# EAGLE design xmas_tree_pcb_A (EAGLE 6.2)
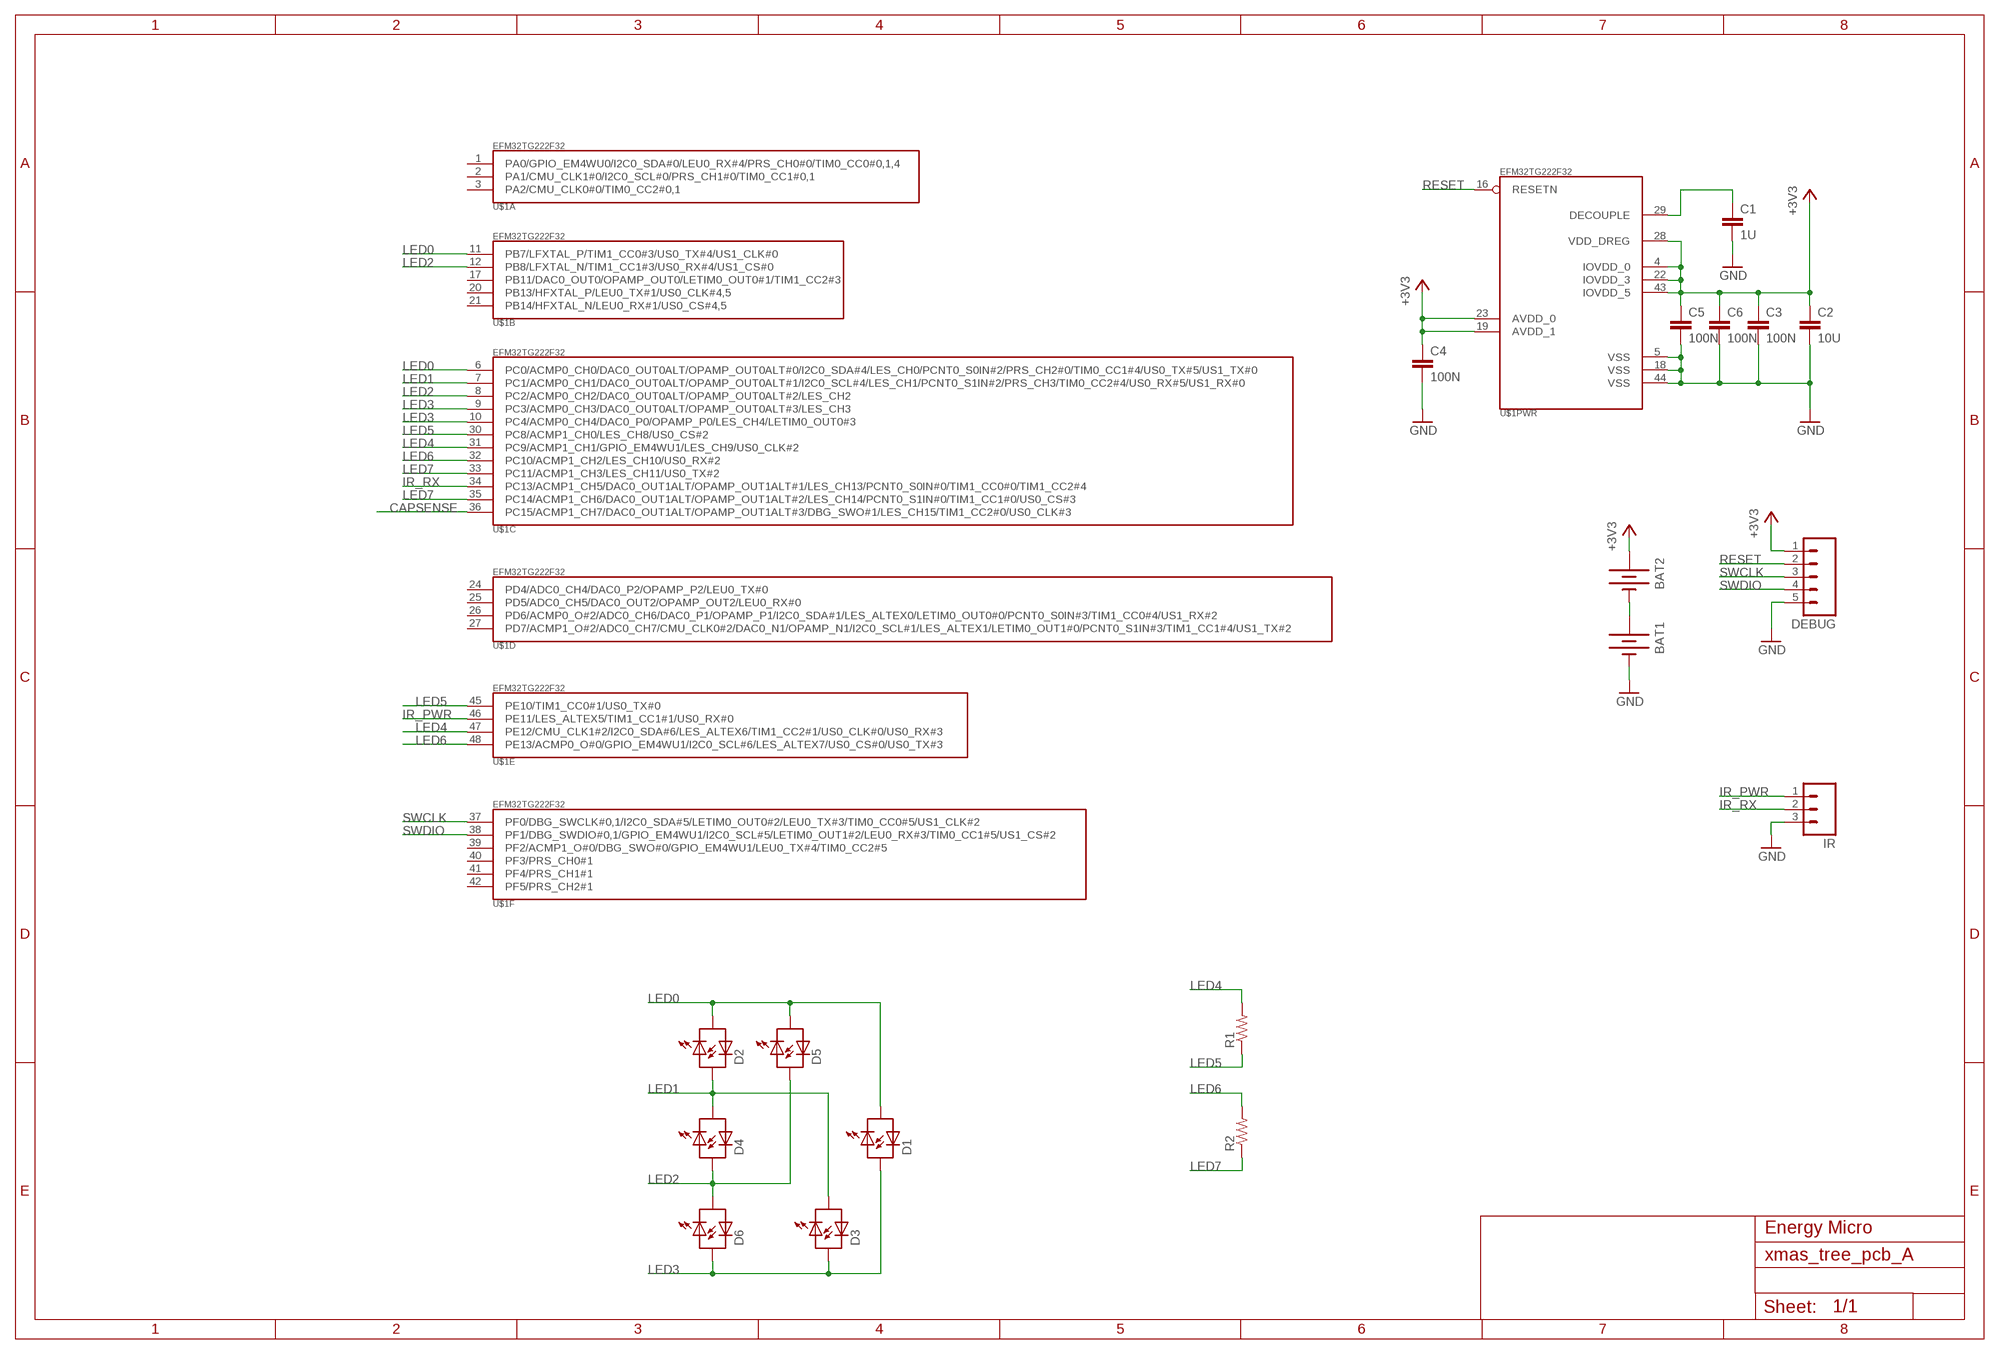
[diagram p0: schematic, sheet 1]

## Parts
BAT1  BATTERYAAA  [BATTERY-AAA]
BAT2  BATTERYAAA  [BATTERY-AAA]
C1  1U  C-EUC0603  [C0603]
C2  10U  C-EUC0603  [C0603]
C3  100N  C-EUC0603  [C0603]
C4  100N  C-EUC0603  [C0603]
C5  100N  C-EUC0603  [C0603]
C6  100N  C-EUC0603  [C0603]
D1  LED_BI_COLOR  [LED3MM]
D2  LED_BI_COLOR  [LED3MM]
D3  LED_BI_COLOR  [LED3MM]
D4  LED_BI_COLOR  [LED3MM]
D5  LED_BI_COLOR  [LED3MM]
D6  LED_BI_COLOR  [LED3MM]
DEBUG  M05LOCK  [1X05_LOCK]
IR  M03LOCK  [1X03_LOCK]
R1  RESISTOR1206  [1206]
R2  RESISTOR1206  [1206]
U$1  EFM32TG222F32  [QFP48]

## Nets
+3V3: BAT2.PWR@1(+) C2.1 C3.1 C4.1 C5.1 C6.1 DEBUG.1 U$1.4(PWR:IOVDD_0) U$1.19(PWR:AVDD_1) U$1.22(PWR:IOVDD_3) U$1.23(PWR:AVDD_0) U$1.28(PWR:VDD_DREG) U$1.43(PWR:IOVDD_5)
CAPSENSE: U$1.36(C:PC15/ACMP1_CH7/DAC0_OUT1ALT/OPAMP_OUT1ALT#3/DBG_SWO#1/LES_CH15/TIM1_CC2#0/US0_CLK#3)
GND: BAT1.GND@1(-) C1.2 C2.2 C3.2 C4.2 C5.2 C6.2 DEBUG.5 IR.3 U$1.5(PWR:VSS) U$1.18(PWR:VSS) U$1.44(PWR:VSS)
IR_PWR: IR.1 U$1.46(E:PE11/LES_ALTEX5/TIM1_CC1#1/US0_RX#0)
IR_RX: IR.2 U$1.34(C:PC13/ACMP1_CH5/DAC0_OUT1ALT/OPAMP_OUT1ALT#1/LES_CH13/PCNT0_S0IN#0/TIM1_CC0#0/TIM1_CC2#4)
LED0: D1.K(C1) D2.K(C1) D5.K(C1) U$1.6(C:PC0/ACMP0_CH0/DAC0_OUT0ALT/OPAMP_OUT0ALT#0/I2C0_SDA#4/LES_CH0/PCNT0_S0IN#2/PRS_CH2#0/TIM0_CC1#4/US0_TX#5/US1_TX#0) U$1.11(B:PB7/LFXTAL_P/TIM1_CC0#3/US0_TX#4/US1_CLK#0)
LED1: D2.A(A1) D3.K(C1) D4.K(C1) U$1.7(C:PC1/ACMP0_CH1/DAC0_OUT0ALT/OPAMP_OUT0ALT#1/I2C0_SCL#4/LES_CH1/PCNT0_S1IN#2/PRS_CH3/TIM0_CC2#4/US0_RX#5/US1_RX#0)
LED2: D4.A(A1) D5.A(A1) D6.K(C1) U$1.8(C:PC2/ACMP0_CH2/DAC0_OUT0ALT/OPAMP_OUT0ALT#2/LES_CH2) U$1.12(B:PB8/LFXTAL_N/TIM1_CC1#3/US0_RX#4/US1_CS#0)
LED3: D1.A(A1) D3.A(A1) D6.A(A1) U$1.9(C:PC3/ACMP0_CH3/DAC0_OUT0ALT/OPAMP_OUT0ALT#3/LES_CH3) U$1.10(C:PC4/ACMP0_CH4/DAC0_P0/OPAMP_P0/LES_CH4/LETIM0_OUT0#3)
LED4: R1.2 U$1.31(C:PC9/ACMP1_CH1/GPIO_EM4WU1/LES_CH9/US0_CLK#2) U$1.47(E:PE12/CMU_CLK1#2/I2C0_SDA#6/LES_ALTEX6/TIM1_CC2#1/US0_CLK#0/US0_RX#3)
LED5: R1.1 U$1.30(C:PC8/ACMP1_CH0/LES_CH8/US0_CS#2) U$1.45(E:PE10/TIM1_CC0#1/US0_TX#0)
LED6: R2.2 U$1.32(C:PC10/ACMP1_CH2/LES_CH10/US0_RX#2) U$1.48(E:PE13/ACMP0_O#0/GPIO_EM4WU1/I2C0_SCL#6/LES_ALTEX7/US0_CS#0/US0_TX#3)
LED7: R2.1 U$1.33(C:PC11/ACMP1_CH3/LES_CH11/US0_TX#2) U$1.35(C:PC14/ACMP1_CH6/DAC0_OUT1ALT/OPAMP_OUT1ALT#2/LES_CH14/PCNT0_S1IN#0/TIM1_CC1#0/US0_CS#3)
N$4: C1.1 U$1.29(PWR:DECOUPLE)
N$11: BAT1.PWR@1(+) BAT2.GND@1(-)
RESET: DEBUG.2 U$1.16(PWR:RESETN)
SWCLK: DEBUG.3 U$1.37(F:PF0/DBG_SWCLK#0,1/I2C0_SDA#5/LETIM0_OUT0#2/LEU0_TX#3/TIM0_CC0#5/US1_CLK#2)
SWDIO: DEBUG.4 U$1.38(F:PF1/DBG_SWDIO#0,1/GPIO_EM4WU1/I2C0_SCL#5/LETIM0_OUT1#2/LEU0_RX#3/TIM0_CC1#5/US1_CS#2)
Unconnected: U$1.1(A:PA0/GPIO_EM4WU0/I2C0_SDA#0/LEU0_RX#4/PRS_CH0#0/TIM0_CC0#0,1,4) U$1.2(A:PA1/CMU_CLK1#0/I2C0_SCL#0/PRS_CH1#0/TIM0_CC1#0,1) U$1.3(A:PA2/CMU_CLK0#0/TIM0_CC2#0,1) U$1.17(B:PB11/DAC0_OUT0/OPAMP_OUT0/LETIM0_OUT0#1/TIM1_CC2#3) U$1.20(B:PB13/HFXTAL_P/LEU0_TX#1/US0_CLK#4,5) U$1.21(B:PB14/HFXTAL_N/LEU0_RX#1/US0_CS#4,5) U$1.24(D:PD4/ADC0_CH4/DAC0_P2/OPAMP_P2/LEU0_TX#0) U$1.25(D:PD5/ADC0_CH5/DAC0_OUT2/OPAMP_OUT2/LEU0_RX#0) U$1.26(D:PD6/ACMP0_O#2/ADC0_CH6/DAC0_P1/OPAMP_P1/I2C0_SDA#1/LES_ALTEX0/LETIM0_OUT0#0/PCNT0_S0IN#3/TIM1_CC0#4/US1_RX#2) U$1.27(D:PD7/ACMP1_O#2/ADC0_CH7/CMU_CLK0#2/DAC0_N1/OPAMP_N1/I2C0_SCL#1/LES_ALTEX1/LETIM0_OUT1#0/PCNT0_S1IN#3/TIM1_CC1#4/US1_TX#2) U$1.39(F:PF2/ACMP1_O#0/DBG_SWO#0/GPIO_EM4WU1/LEU0_TX#4/TIM0_CC2#5) U$1.40(F:PF3/PRS_CH0#1) U$1.41(F:PF4/PRS_CH1#1) U$1.42(F:PF5/PRS_CH2#1)

## Notes on the sheet
- Energy Micro

## Library data of the parts
BAT1 BAT2 = SparkFun_mod:BATTERY: Battery Holders Various common sizes : AA, AAA, 20mm coin cell and 12mm coin cell.
C1-C6 = rcl:C-EU: CAPACITOR, European symbol
D1-D6 = SparkFun_mod:LED_BI_COLOR
DEBUG = SparkFun_mod:M05: Header 5 Standard 5-pin 0.1" header. Use with straight break away headers (SKU : PRT-00116), right angle break away headers (PRT-00553), swiss pins (PRT-00743), machine pins (PRT-00117), and female headers (PRT-00115). Molex polarized connector foot print use with SKU : PRT-08230 with associated crimp pins and housings.
IR = SparkFun_mod:M03: Header 3 Standard 3-pin 0.1" header. Use with straight break away headers (SKU : PRT-00116), right angle break away headers (PRT-00553), swiss pins (PRT-00743), machine pins (PRT-00117), and female headers (PRT-00115). Molex polarized connector foot print use with SKU : PRT-08232 with associated crimp pins and housings.
R1 R2 = SparkFun_mod:RESISTOR: Resistor Basic schematic elements and footprints for 0603, 1206, and PTH 1/10th watt (small) resistors.
U$1 = EnergyMicro:EFM32TG222F32: EFM32TG222F32 Tiny Microcontroller in 7mm x 7mm QFP48 package

## Board
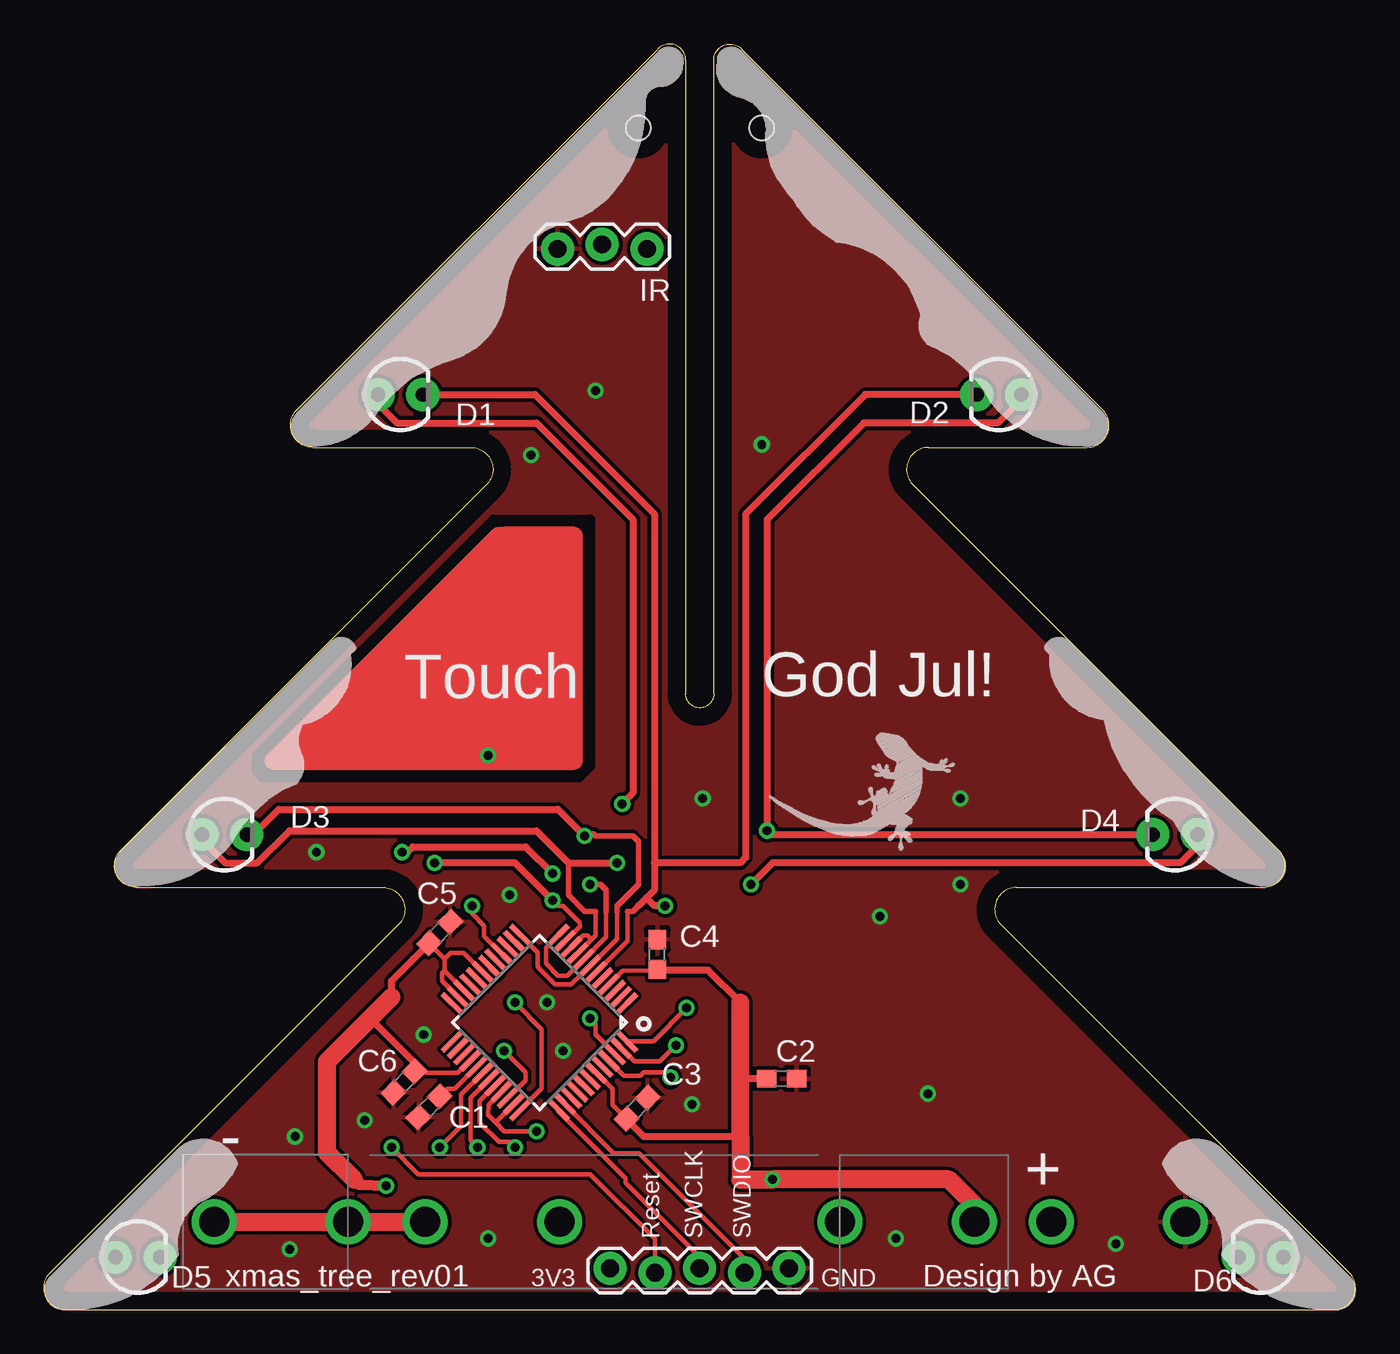
[diagram p1: board, top side]
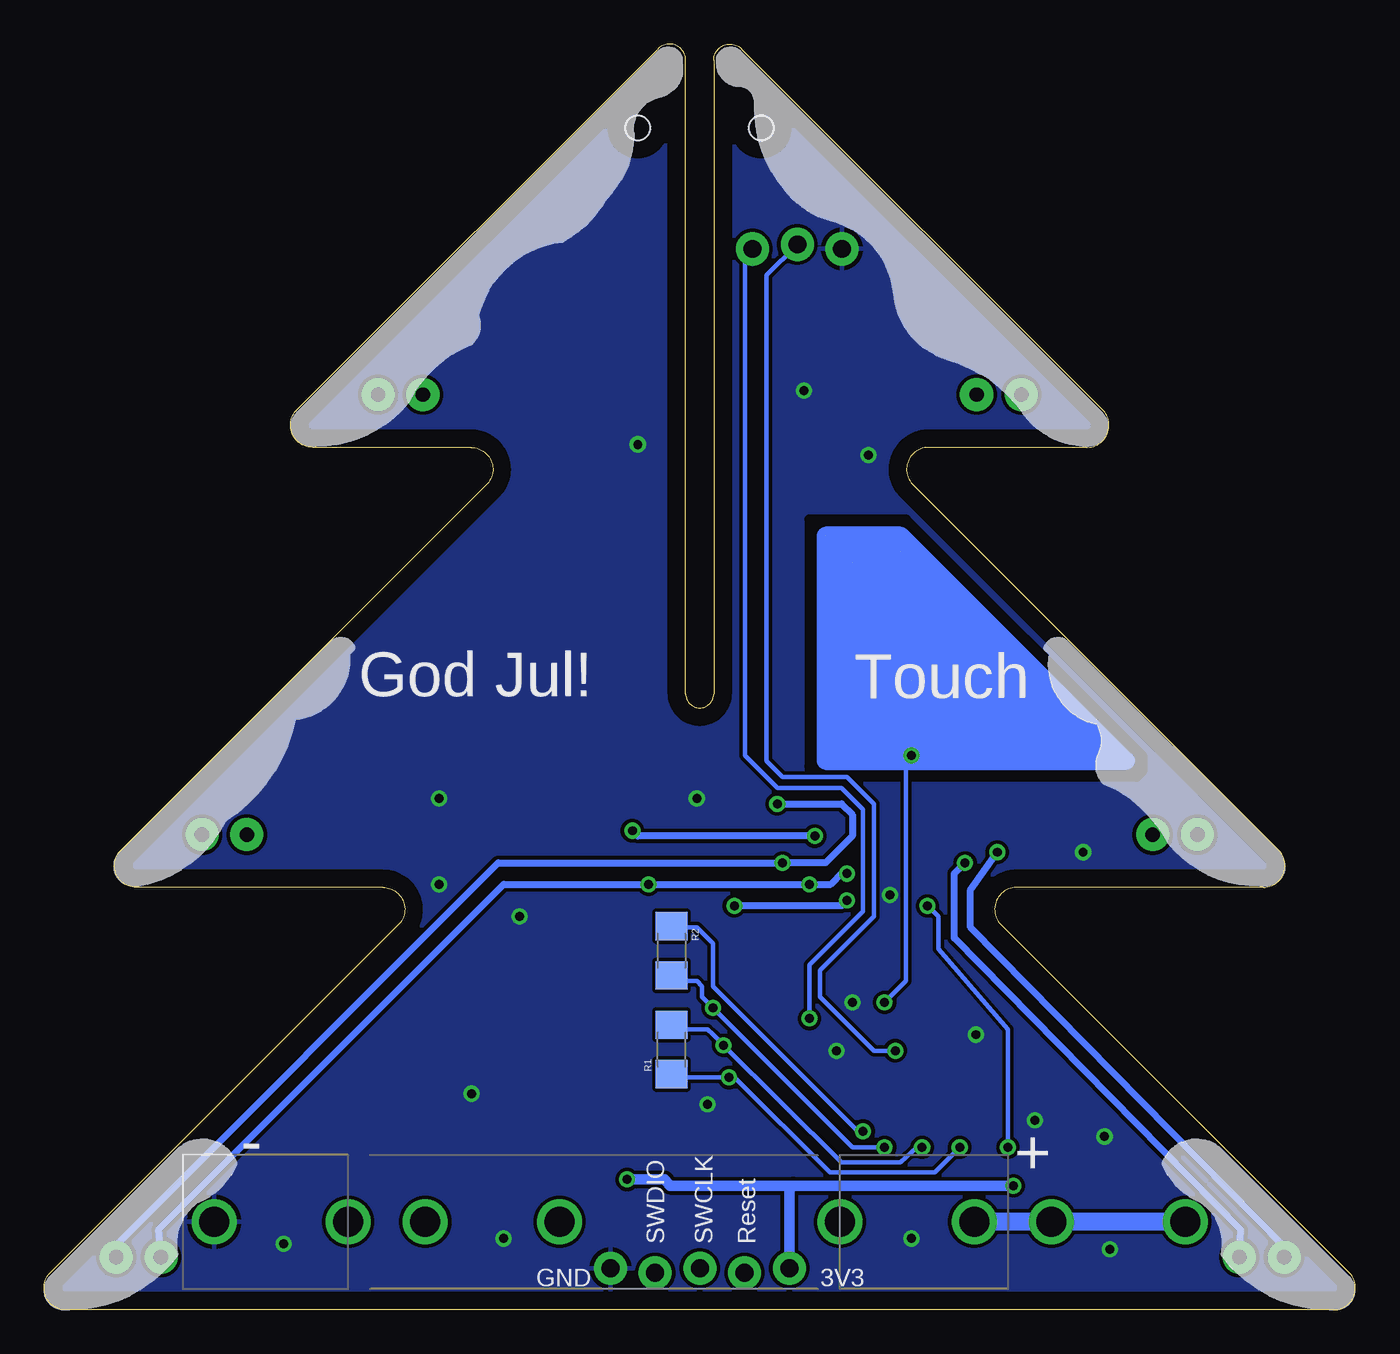
[diagram p2: board, bottom side, seen from below]

Size 74.5 x 71.91 mm. Coordinates in mm from the lower left corner, seen from the top.
Outline: 55.25,24 69.25,24 arc127 70.25,26 49.25,47 arc-127 50.25,49 59.25,49 arc127 60.25,51 39.65,71.6 arc139 38.05,71 38.05,35 arc-180 36.45,35 36.45,71 arc139 34.85,71.6 14.25,51 arc127 15.25,49 24.25,49 arc-127 25.25,47 4.25,26 arc127 5.25,24 19.25,24 arc-127 20.25,22 0.25,2 arc127 1.25,0 73.25,0 arc127 74.25,2 54.25,22 arc-127 55.25,24
Copper layers (1*16): Top 0.035mm / dielectric 1.5mm / Bottom 0.035mm
Design rules: minimum track width 10mil, minimum drill 20mil, track to track 8mil, track to pad 8mil, pad to pad 6mil, via to via 8mil, smd to smd 6mil, copper to edge 40mil, drill to drill 8mil, minimum pad ring 10mil, minimum via ring 8mil, stop-mask expansion 4mil, vias tented up to drill 20mil, thermal gap 10mil
Holes 1.4 mm at 33.76,67.15 40.77,67.15
tRestrict: 7 lines
bRestrict: 7 lines

### Footprints (pad centres in the part's own frame; a part is rotated, then mirrored left to right if it is on the bottom)
BATTERY-AAA = drill 1.702: GND@1 21.59,0; GND@2 13.97,0; PWR@1 -21.59,0; PWR@2 -13.97,0
C0603 = smd 1.1 x 1: 1 -0.85,0; 2 0.85,0
LED3MM = drill 0.813 pad 1.88: A -1.27,0; K 1.27,0
1X05_LOCK = drill 1.016 pad 1.88: 1 0,0.127; 2 2.54,-0.127; 3 5.08,0.127; 4 7.62,-0.127; 5 10.16,0.127
1X03_LOCK = drill 1.016 pad 1.88: 1 0,0.127; 2 2.54,-0.127; 3 5.08,0.127
1206 = smd 1.6 x 1.8: 1 -1.4,0; 2 1.4,0
QFP48 = smd 1.6 x 0.3: 1 -4.25,2.75; 2 -4.25,2.25; 3 -4.25,1.75; 4 -4.25,1.25; 5 -4.25,0.75; 6 -4.25,0.25; 7 -4.25,-0.25; 8 -4.25,-0.75; 9 -4.25,-1.25; 10 -4.25,-1.75; 11 -4.25,-2.25; 12 -4.25,-2.75; 25 4.25,-2.75; 26 4.25,-2.25; 27 4.25,-1.75; 28 4.25,-1.25; 29 4.25,-0.75; 30 4.25,-0.25; 31 4.25,0.25; 32 4.25,0.75; 33 4.25,1.25; 34 4.25,1.75; 35 4.25,2.25; 36 4.25,2.75 | smd 0.3 x 1.6: 13 -2.75,-4.25; 14 -2.25,-4.25; 15 -1.75,-4.25; 16 -1.25,-4.25; 17 -0.75,-4.25; 18 -0.25,-4.25; 19 0.25,-4.25; 20 0.75,-4.25; 21 1.25,-4.25; 22 1.75,-4.25; 23 2.25,-4.25; 24 2.75,-4.25; 37 2.75,4.25; 38 2.25,4.25; 39 1.75,4.25; 40 1.25,4.25; 41 0.75,4.25; 42 0.25,4.25; 43 -0.25,4.25; 44 -0.75,4.25; 45 -1.25,4.25; 46 -1.75,4.25; 47 -2.25,4.25; 48 -2.75,4.25

### Placement (x,y rotation side)
BAT1  43.25,5 180 bottom
BAT2  31.25,5 180 top
C1  21.87,11.54 225 top
C2  41.9,13.14 0 top
C3  33.69,11.46 45 top
C4  34.84,20.19 90 top
C5  22.48,21.44 45 top
C6  20.45,12.95 225 top
D1  20.25,52 0 top
D2  54.25,52 180 top
D3  10.25,27 0 top
D4  64.25,27 180 top
D5  5.33,3 0 top
D6  69.12,3 180 top
DEBUG  32.16,2.24 0 top
IR  34.25,60.4 180 top
R1  38.85,14.8 90 bottom
R2  38.85,20.4 270 bottom
U$1  28.15,16.33 225 top
U$2  [GECKO_BOTTOM]  52.35,30.58 270 top
U$30  GECKO  [GECKO]  45.55,29.81 270 top

### Tracks (layer width: path | path; a pad name or v marks a point on that pad's centre or on a via)
+3V3  (via drill 0.51)
  Top 0.254: U$1.28 23.5,13.46 21.76,13.46 C6.1 | U$1.22 22.76,19.25 22.76,19.3 | 22.76,19.3 22.76,19.95 | 22.76,19.95 C5.1 | U$1.23 22.61,18.69 22.61,19.15 22.76,19.3 | U$1.43 31.35,13.5 32.29,12.57 32.29,11.66 C3.1 | U$1.4 32.06,18.46 32.87,19.27 34.79,19.3 C4.1 | U$1.19 23.83,20.29 23.1,20.29 22.76,19.95
  Top 0.406: 19.74,17.77 19.74,18.69 20.96,19.91 20.96,19.92 C5.1 | C2.1 39.57,13.14 39.55,10.15 | C6.1 21.52,13.55 18.52,16.55 | 39.55,17.47 37.72,19.3 34.88,19.3 C4.1 | C3.1 33.09,10.83 34.07,9.85 39.55,9.85
  Top 0.61: v19.44,7.06 17.91,7.11 17.61,7.41
  Top 1.016: BAT2.PWR@1 52.84,5.97 51.4,7.41 v41.38,7.41 39.55,7.41 39.55,9.85 39.55,10.15 39.55,17.47 | 17.61,7.41 16.08,8.94 16.08,14.12 18.52,16.55 19.74,17.77
  Bottom 0.61: v41.38,7.41 39.25,7.41 38.94,7.06 31.93,7.06 | 31.93,7.06 v19.44,7.06 | DEBUG.1 32.16,6.82 31.93,7.06
CAPSENSE  (via drill 0.51)  (4 unrouted)
  Top 0.254: v26.75,17.47 28.27,15.95 28.27,12.59 27.36,11.68 27.36,11.65 U$1.36 | v25.23,31.49 25.23,32.1
  Top 1.016: 26.14,43.99 30.1,43.99 30.1,31.19 13.03,31.19 25.84,43.99 26.14,43.99 | 14.56,31.8 26.14,43.38 | 26.14,43.38 27.06,43.38 15.47,31.8 16.69,31.8 16.69,32.1 27.97,43.38 | 25.53,35.15 25.23,35.15 25.23,35.76 | 26.45,32.1 25.23,32.1 25.23,32.41 | 26.14,43.99 26.14,43.38 | 26.14,43.38 26.14,43.07 25.84,43.07 25.84,42.46
  Top 2.54: 28.58,33.01 28.58,32.71 28.88,32.41 28.88,42.46 28.58,42.46 18.22,32.1 26.45,32.1 27.06,32.71 27.06,38.5 27.36,38.81 27.06,38.81 21.87,33.62 24.62,33.62 25.23,34.23 25.23,34.84 25.53,35.15
  Bottom 0.254: v26.75,17.47 25.53,18.69 25.53,31.19 v25.23,31.49
  Bottom 1.016: 13.95,31.8 29.19,31.8 29.49,32.1 29.49,43.07 26.6,43.07 | 25.68,42.92 25.84,43.07 26.6,43.07 | 25.68,42.92 15.17,32.41 28.58,32.41 28.58,42.16 | 28.27,42.16 26.14,42.16 25.84,42.46 25.53,42.16 | 26.6,43.07 26.6,42.92 25.68,42.92 | 13.03,31.19 25.84,43.99 30.1,43.99 30.1,31.19 13.03,31.19
  Bottom 2.54: 17.61,33.32 17,33.32 16.69,33.01 17.91,33.01 25.53,40.63 27.06,40.63 27.36,40.94 27.36,33.93 27.66,33.62 20.35,33.62 20.04,33.32 20.35,33.32 25.53,38.5 25.53,36.06 25.23,35.76 24.62,35.76 24.01,35.15 | 28.27,42.16 28.58,42.16 28.58,42.46
GND  (via drill 0.51)
  other vias: 27.66,48.56 31.32,52.22 36.81,11.68 47.48,22.35 52.05,24.18 52.05,29.05 37.42,29.05 40.77,49.17 21.57,15.64 15.47,26 28.58,17.47 29.49,14.73 26.45,23.57 14.25,9.85 18.22,10.76 25.23,4.06 13.95,3.45 48.39,4.06 60.89,3.75 50.22,12.29
  pour Top (isolate 0.152): -0.68,-0.21 -0.68,74.47 75.82,74.47 75.82,-1.12 -0.68,-1.12
  pour Bottom (isolate 0.152): -0.68,-0.82 75.82,-0.82 75.82,75.38 -0.68,75.38
IR_PWR  (via drill 0.51)
  Top 0.254: U$1.46 32.39,14.57 31.32,15.64 31.32,16.25 v31.02,16.55
  Bottom 0.254: 34.25,59.41 IR.1 34.68,59.85 34.68,31.49 32.85,29.66 29.19,29.66 27.97,28.44 27.97,22.65 31.02,19.6 31.02,17.16 v31.02,16.55
IR_RX  (via drill 0.51)
  Top 0.254: U$1.34 26.4,12.09 27.36,13.05 27.36,13.51 v26.14,14.73
  Bottom 0.254: 31.63,60.44 IR.2 33.46,58.78 33.46,31.19 32.54,30.27 28.88,30.27 27.36,28.75 27.36,22.35 30.41,19.3 30.41,17.77 27.36,14.73 v26.14,14.73
LED0  (via drill 0.51)
  Top 0.254: U$1.6 33.15,20.98 33.15,22.65 | U$1.11 29.56,20.92 30.46,21.79 30.43,22.02 29.49,22.96 29.19,22.96 v28.88,23.26
  Top 0.305: 33.15,22.65 33.46,22.65 33.76,22.96
  Top 0.406: D2.K 46.65,52 39.86,45.21 39.86,25.7 39.55,25.39 34.68,25.39 | D1.K 27.88,52 34.68,45.21 34.68,25.39 | 34.68,25.39 34.68,23.87 34.22,23.41 | 34.22,23.41 33.76,22.96 | v35.28,22.96 34.68,22.96 34.22,23.41 | v28.88,23.26 26.75,25.39 v22.18,25.39
  Bottom 0.406: v35.28,22.96 29.19,22.96 v28.88,23.26 | D5.K 6.52,4.55 22.79,21.13 22.79,24.79 v22.18,25.39
LED1  (via drill 0.51)
  Top 0.254: U$1.7 32.54,21.08 32.54,22.65
  Top 0.305: 32.54,22.65 32.54,22.96 33.76,24.18 33.76,26.61 33.46,26.92 31.32,26.92 31.24,27
  Top 0.406: D2.A 55.52,51.73 54.18,50.39 46.56,50.39 41.08,44.9 v41.08,27.22 41.08,27 D4.K | 31.24,27 v30.71,26.92 29.19,28.44 13.34,28.44 11.9,27 D3.K
  Bottom 0.406: v30.71,26.92 40.77,26.92 v41.08,27.22
LED2  (via drill 0.51)
  Top 0.254: 31.93,22.65 31.93,21.18 U$1.8 29.72,18.97 29.21,18.97 28.53,19.68 28.53,20.57 U$1.12
  Top 0.305: 31.93,22.65 31.93,23.87 31.63,24.18 v31.02,24.18
  Top 0.406: D4.A 65.52,26.37 64.55,25.39 41.38,25.39 v40.16,24.18 | v20.35,26 20.65,26 20.96,26.31 27.36,26.31 v28.88,24.79
  Bottom 0.406: D5.A 3.98,3.54 21.87,21.74 21.87,23.87 v20.35,26 | D6.K 67.98,4.59 48.39,24.18 v40.16,24.18 v31.02,24.18 29.8,24.18 29.19,24.79 v28.88,24.79
LED3  (via drill 0.51)
  Top 0.254: U$1.9 31.09,21.05 | 31.09,21.05 31.32,21.28 31.32,22.65 | U$1.10 29.92,20.58 30.61,21.28 30.87,21.28 31.09,21.05
  Top 0.305: 31.32,22.65 30.71,22.65 29.8,23.57 29.8,25.39
  Top 0.406: D1.A 18.98,51.45 20.04,50.39 27.97,50.39 33.46,44.9 33.46,29.36 v32.85,28.75 | D3.A 8.98,26.71 10.29,25.39 12.12,25.39 13.95,27.22 27.97,27.22 29.8,25.39 v32.54,25.39
  Bottom 0.406: v32.85,28.75 29.19,28.75 28.58,28.14 28.58,26.92 30.1,25.39 v32.54,25.39 48.7,25.39 70.52,3.57 D6.A
LED4  (via drill 0.51)
  Top 0.254: U$1.31 24.24,12.06 24.24,9.62 v24.62,9.24 | U$1.47 32.76,14.92 33.56,14.12 34.98,14.12 35.74,14.88 | 35.74,14.88 | 35.74,14.88 v35.89,15.03
  Bottom 0.254: v24.62,9.24 24.92,9.24 25.84,8.38 29.21,8.38 v35.89,15.03 | v35.89,15.03 36.5,15.64 | 36.5,15.64 36.81,15.95 38.6,15.95 R1.2 | v35.89,15.03 36.5,15.64
LED5  (via drill 0.51)
  Top 0.254: U$1.30 23.7,12.24 23.7,10.46 v22.48,9.24 | U$1.45 32.95,13.3 33.86,13.3 34.07,13.51 35.28,13.51 v35.59,13.2
  Bottom 0.254: v22.48,9.24 23.88,7.82 29.85,7.82 35.28,13.2 v35.59,13.2 36.2,13.2 38.65,13.2 R1.1
LED6  (via drill 0.51)
  Top 0.254: U$1.32 25.67,12.79 24.74,11.88 24.74,10.64 25.84,9.54 26.45,9.54 v26.75,9.24 | U$1.48 34.61,15.27 v36.5,17.16
  Bottom 0.254: v26.75,9.24 28.58,9.24 v36.5,17.16 36.81,17.47 37.11,17.77 37.11,18.38 37.42,18.69 38.54,18.69 R2.2
LED7  (via drill 0.51)
  Top 0.254: U$1.33 26.01,12.42 25.25,11.65 25.23,11.07 25.66,10.66 | 25.66,10.66 26.14,10.15 v27.97,10.15 | U$1.35 26.71,11.71 25.66,10.66
  Bottom 0.254: v27.97,10.15 28.27,10.15 36.5,18.38 36.5,20.82 37.42,21.74 38.79,21.74 R2.1
N$1
  Top 0.254: 30.59,19.12 29.95,18.49 29.04,18.49 28.1,19.43 28.1,19.45 28.05,19.5 28.05,20.31 27.06,21.3
N$4
  Top 0.254: U$1.29 23.32,12.57 22.9,12.57 C1.1
N$11
  Top 1.016: BAT2.GND@1 BAT1.PWR@1
  Bottom 1.016: BAT2.GND@1 21.55,5 21.61,5.06
RESET  (via drill 0.51)
  Top 0.254: DEBUG.2 34.7,4.03 31.02,7.72 21.26,7.72 v19.74,9.24 | U$1.16 26.01,20.22 25.01,21.22 25.01,21.83 24.31,22.52 v24.31,22.96
  Bottom 0.254: v19.74,9.24 19.74,15.95 23.7,20.52 23.7,22.35 v24.31,22.96
SWCLK
  Top 0.254: U$1.37 29.21,11.3 33.02,7.49 33.02,7.23 37.24,3.02 DEBUG.3
SWDIO
  Top 0.254: U$1.38 29.56,11.71 32.36,8.91 33.79,8.91 39.78,2.91 DEBUG.4

### Text on the board
_tsilk: Touch | God Jul! | - | + | Reset | SWCLK | SWDIO | xmas_tree_rev01 | 3V3 | GND | Design by AG
_bsilk: Touch | God Jul! | + | - | Reset | SWCLK | SWDIO | 3V3 | GND